# Altium project Project_Name.PrjPcb
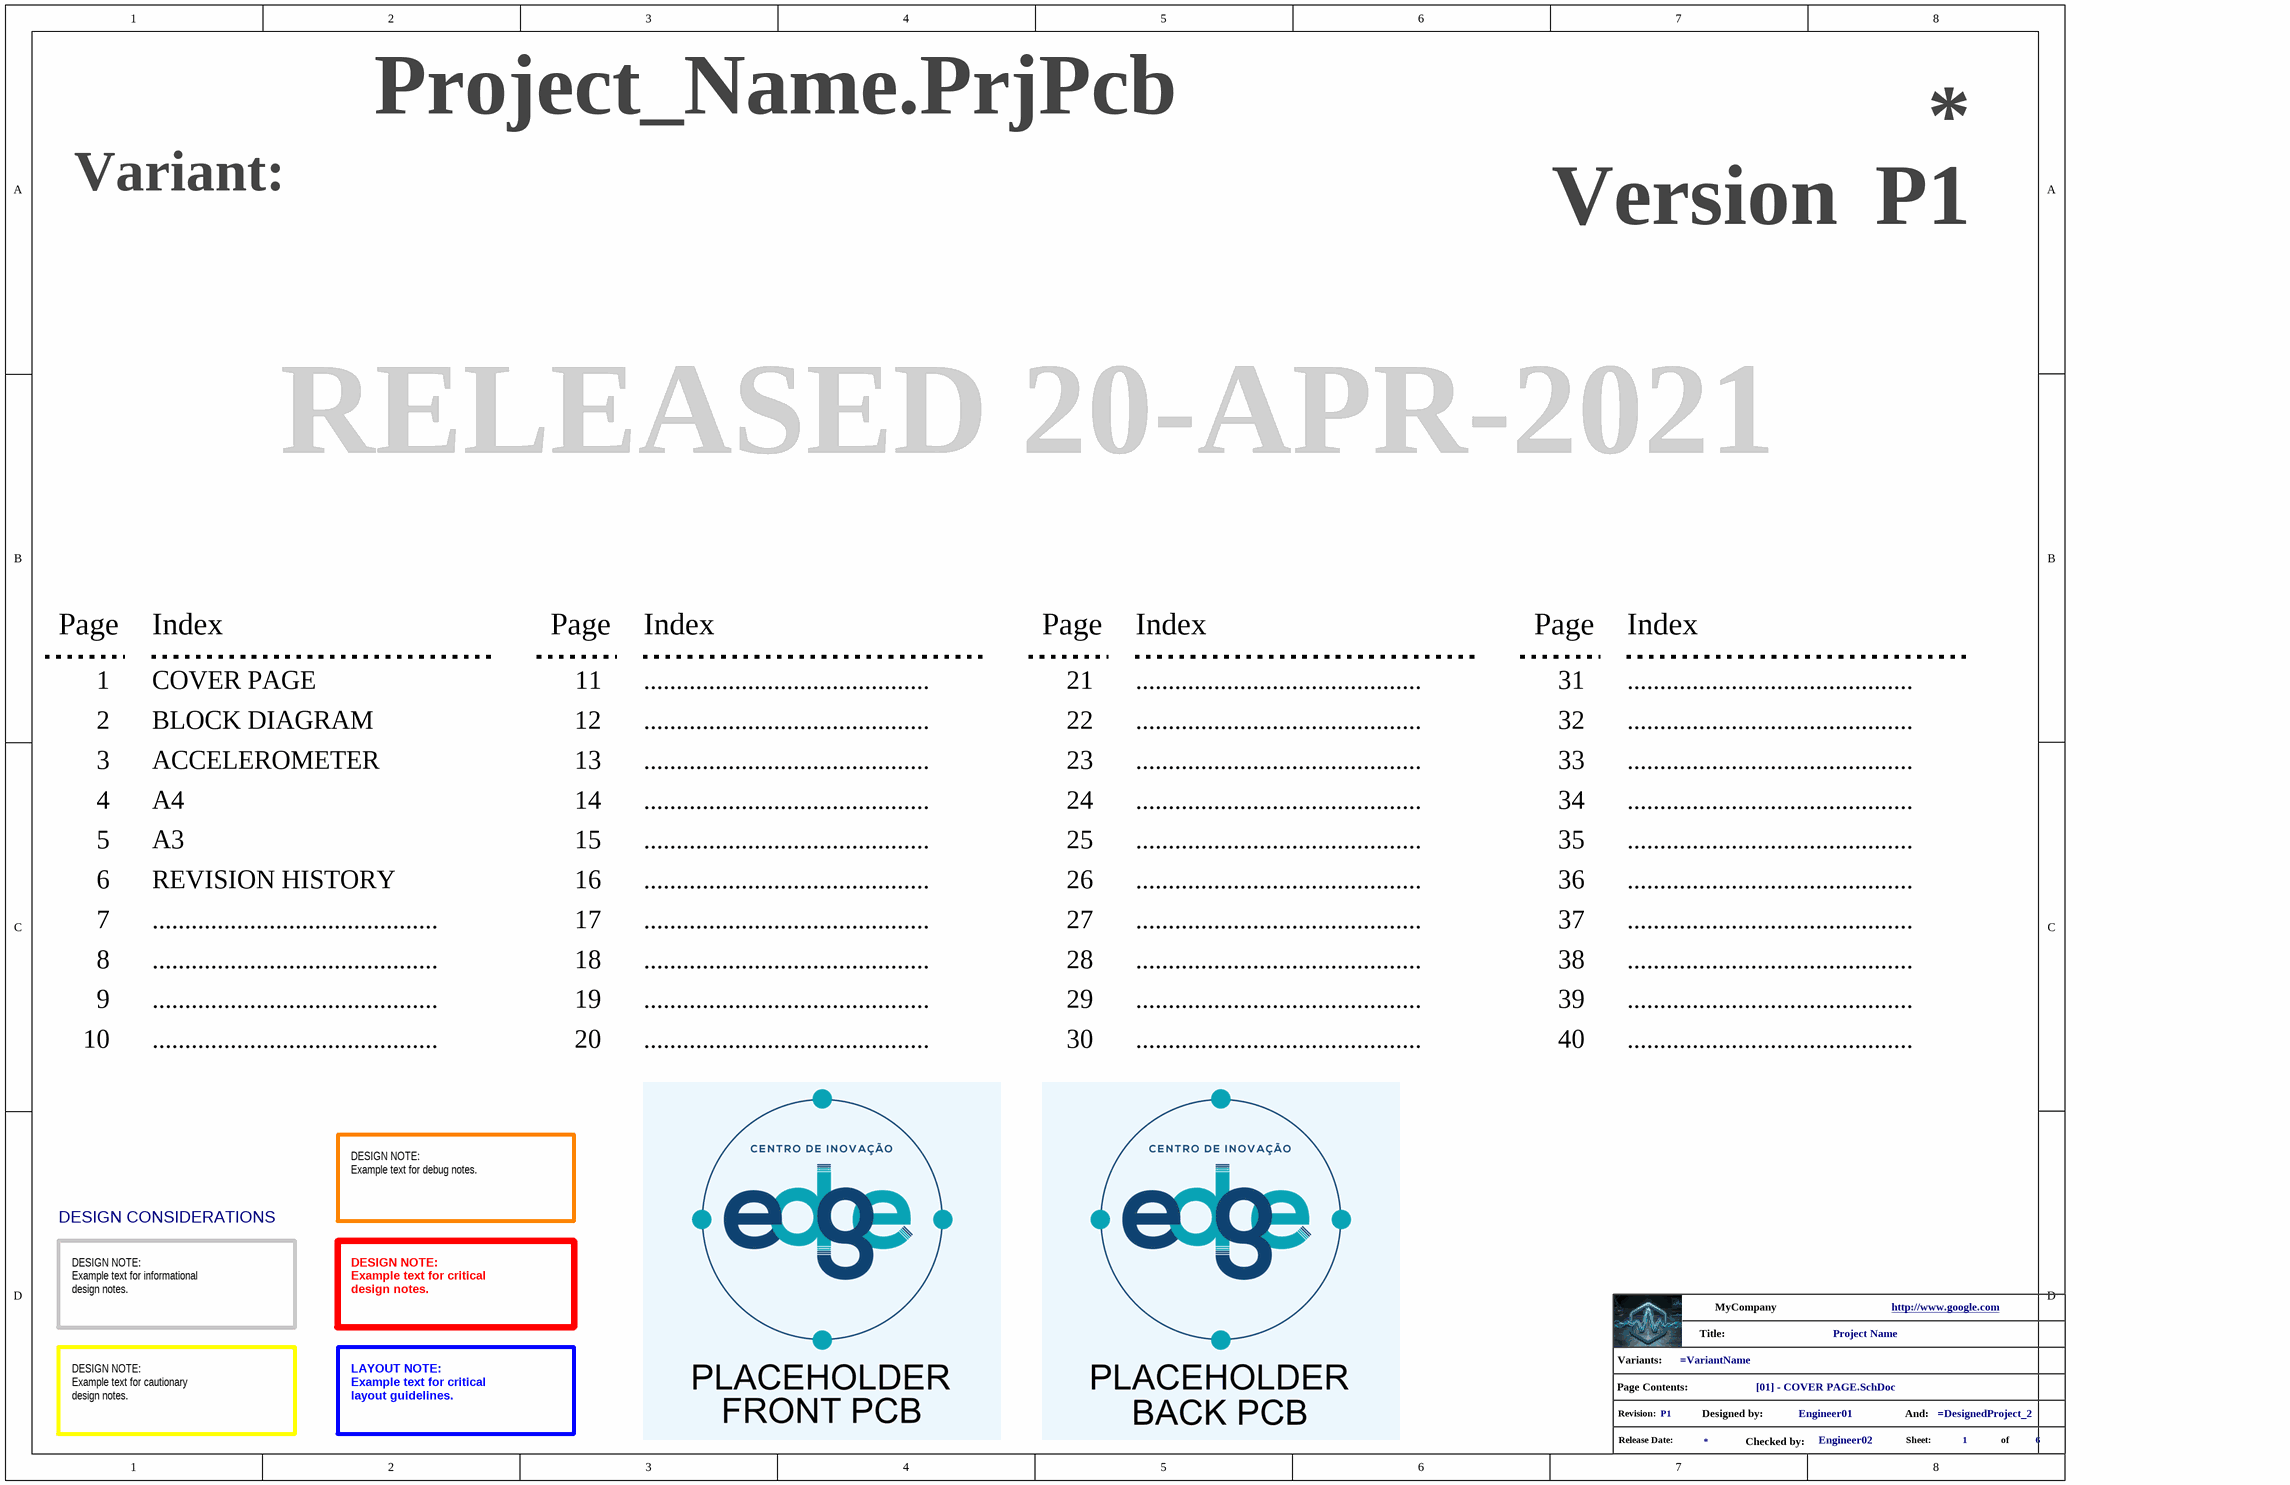
[diagram p0: [01] - COVER PAGE.SchDoc]
CheckedProject: Engineer02; Company: MyCompany; DesignedProject: Engineer01; TitleProject: Project Name; VersionRevision: P1; Website: http://www.google.com
2 sheets, 2 parts. Net scope: global (net labels, ports and power ports of the same name join across sheets).
Board file: Project_Name.PcbDoc
Sheets:
  [01] - COVER PAGE.SchDoc
  [02] - BLOCK DIAGRAM.SchDoc

## Sheet [01] - COVER PAGE.SchDoc
size A3; DocumentNumber: 1; SheetNumber: 1; SheetTotal: 6

### Parts
(Parts that share a designator on the sheet are numbered #1, #2 ... from top to bottom, then left to right.)
*?#1  info_project  (value not drawn)  (graphical)

### Notes on the sheet
- Variant:
- Version
- RELEASED 20-APR-2021
- Page
- Index
- 1
- COVER PAGE
- 11
- ............................................
- 21
- 31
- 2
- 3
- BLOCK DIAGRAM
- ACCELEROMETER
- 12
- 13
- 22
- 23
- 32
- 33
- 4
- A4
- 14
- 24
- 34
- 5
- 6
- A3
- REVISION HISTORY
- 15
- 16
- 25
- 26
- 35
- 36
- 7
- 8
- 17
- 18
- 27
- 28
- 37
- 38
- 9
- 19
- 29
- 39
- 10
- 20
- 30
- 40
- DESIGN CONSIDERATIONS
- DESIGN NOTE:
  Example text for debug notes.
- DESIGN NOTE:
  Example text for informational
  design notes.
- DESIGN NOTE:
  Example text for critical
  design notes.
- DESIGN NOTE:
  Example text for cautionary
  design notes.
- LAYOUT NOTE:
  Example text for critical
  layout guidelines.
- (in symbol info_project) Title:; Variants:; Page Contents:; Revision:; Designed by:; And:; Release Date:; Checked by:; Sheet:; of

### Library data of the parts
*?#1 = info_project: GRAPHICAL - Info Project

## Sheet [02] - BLOCK DIAGRAM.SchDoc
size A2; DocumentNumber: 2; SheetNumber: 2; SheetTotal: 6; PageSetup: Record=PageOptions|CenterHorizontal=True|CenterVertical=True|PrintScale=0.52|XCorrection=1.00|YCorrection=1.00|PrintKind=1|BorderSize=5000000|LeftOffset=0|BottomOffset=0|Orientation=2|PaperLength=1000|PaperWidth=1000|Scale=100|PaperSource=4|PrintQuality=600|MediaType=1|DitherType=10|PrintScaleMode=1|PaperKind=A4|PaperIndex=9
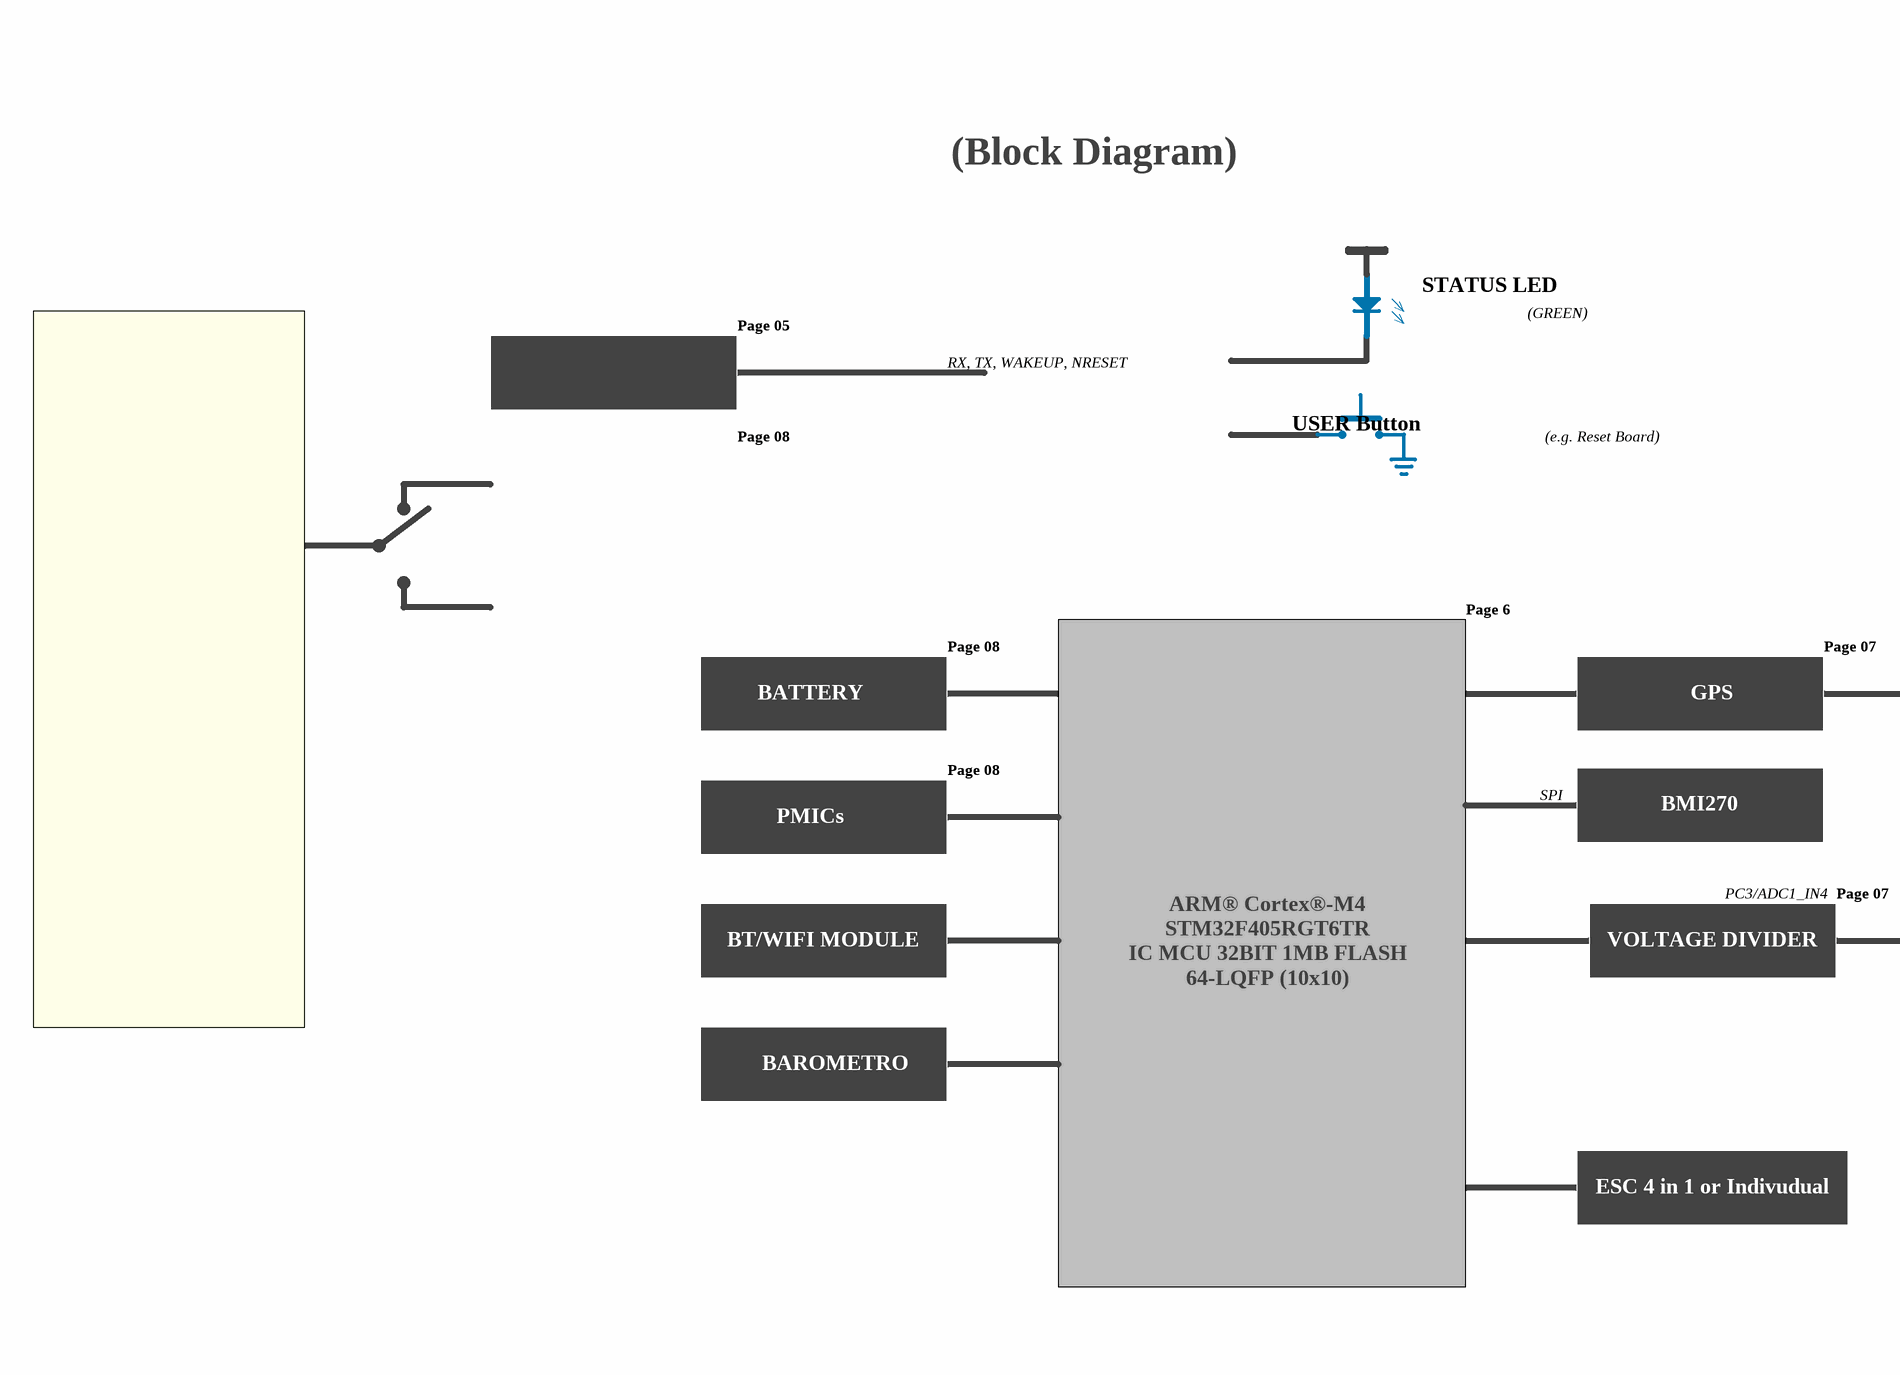
[diagram p1: [02] - BLOCK DIAGRAM.SchDoc, left]
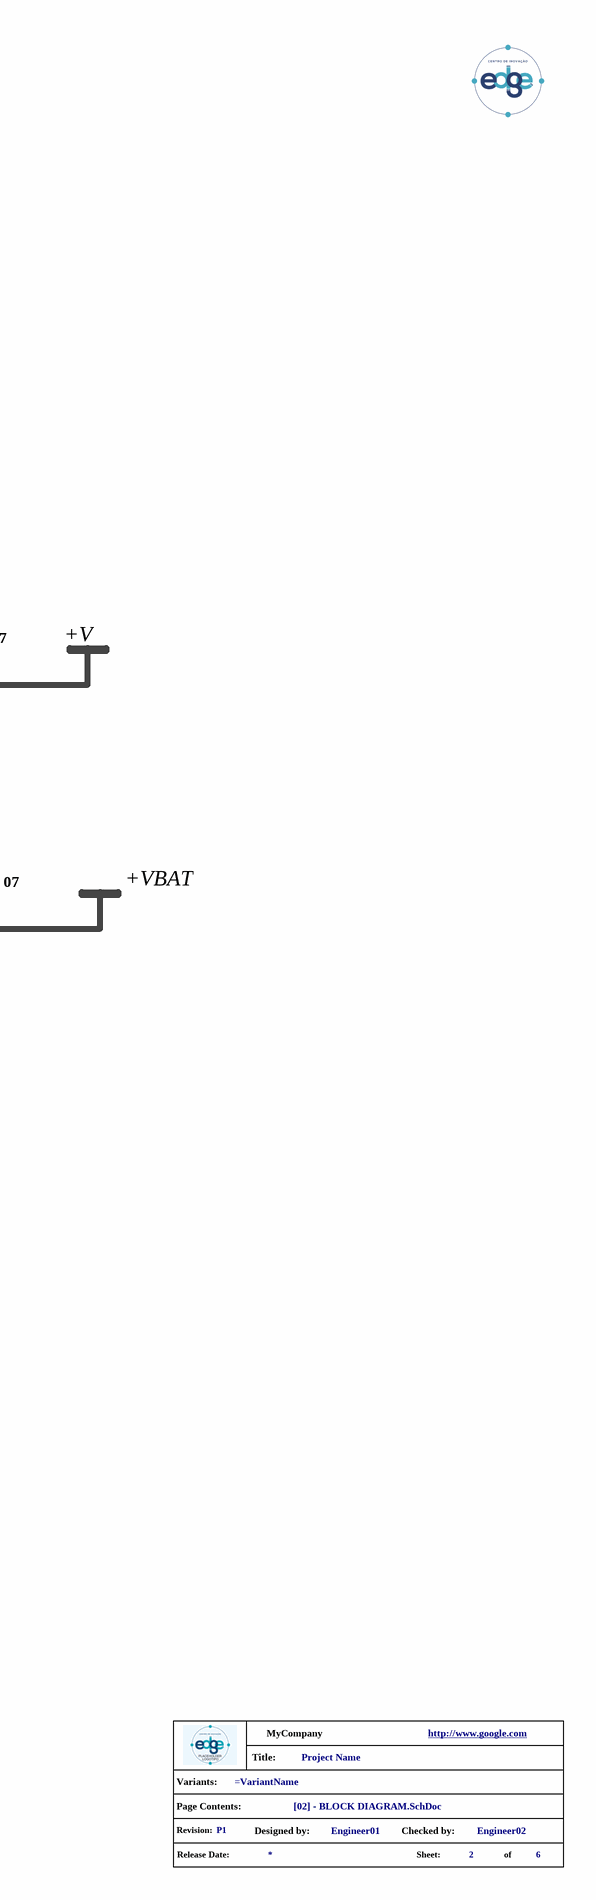
[diagram p2: [02] - BLOCK DIAGRAM.SchDoc, right]

### Parts
(Parts that share a designator on the sheet are numbered #1, #2 ... from top to bottom, then left to right.)
*?#2  info_project  (value not drawn)  (graphical)

### Notes on the sheet
- (Block Diagram)
- Page 05
- STATUS LED
- (GREEN)
- RX, TX, WAKEUP, NRESET
- USER Button
- Page 08
- (e.g. Reset Board)
- Page 6
- Page 07
- +V
- BATTERY
- GPS
- PMICs
- SPI
- BMI270
- ARM® Cortex®-M4
- PC3/ADC1_IN4
- +VBAT
- BT/WIFI MODULE
- STM32F405RGT6TR
- IC MCU 32BIT 1MB FLASH
- VOLTAGE DIVIDER
- 64-LQFP (10x10)
- BAROMETRO
- ESC 4 in 1 or Indivudual
- (in symbol info_project) Title:; Variants:; Page Contents:; Revision:; Designed by:; Checked by:; Release Date:; Sheet:; of